# EAGLE schematic Xbee Communications Board (EAGLE 9.6.1)
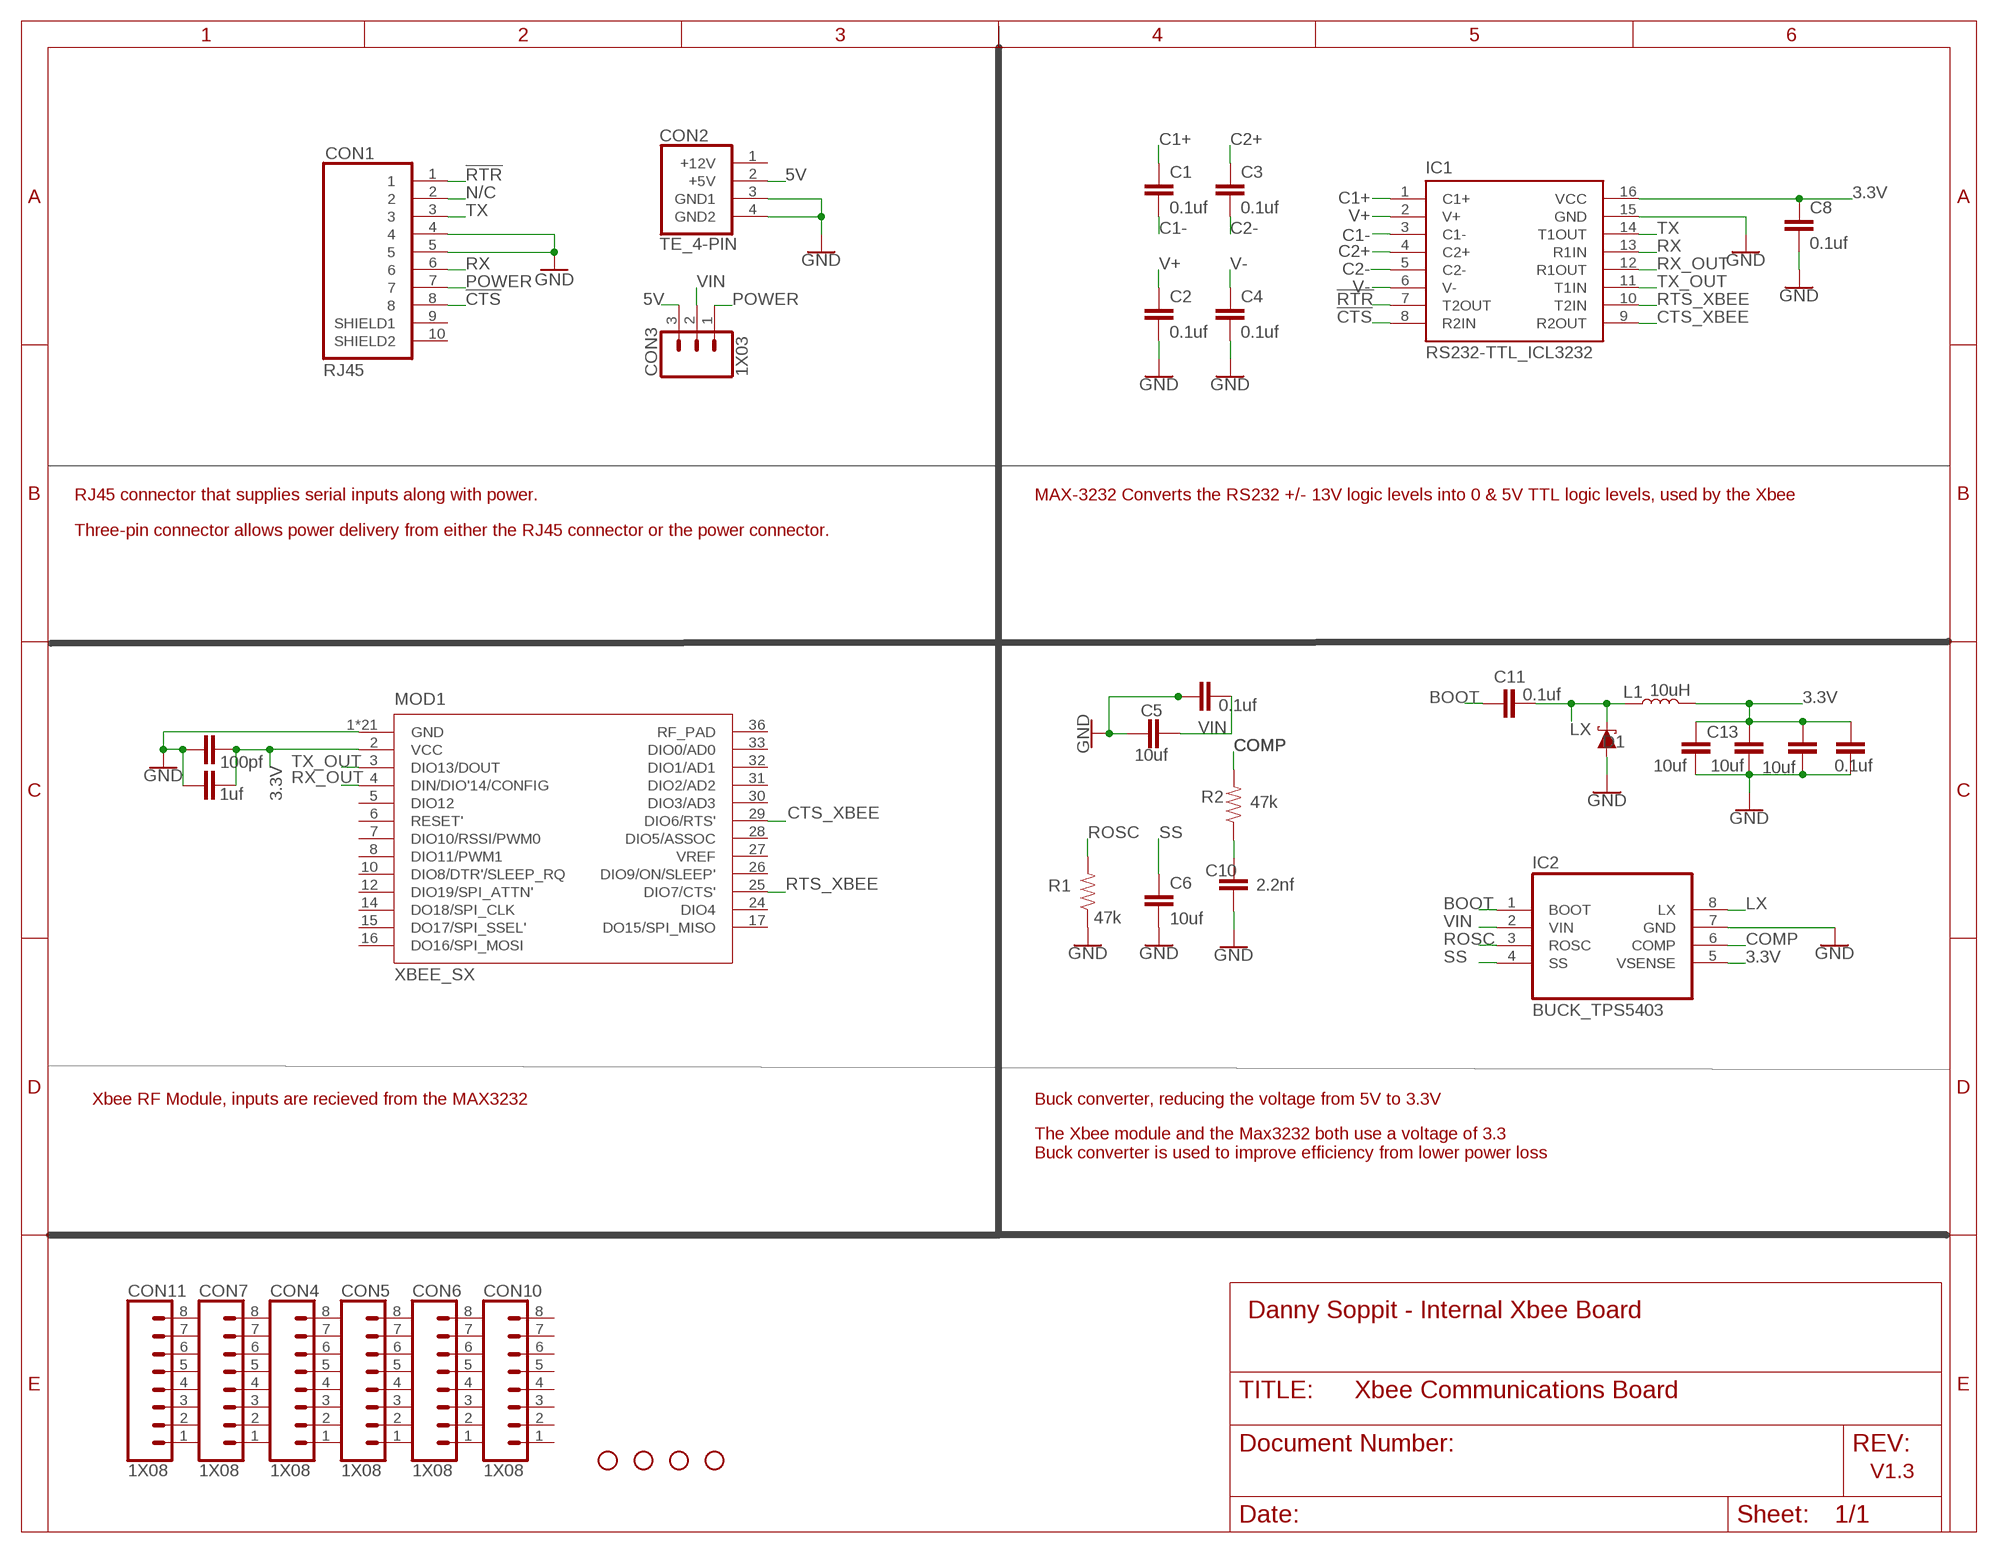
[diagram p0: schematic, sheet 1]

## Parts
C1  0.1uf  CAPACITOR_0805  [0805]
C2  0.1uf  CAPACITOR_0805  [0805]
C3  0.1uf  CAPACITOR_0805  [0805]
C4  0.1uf  CAPACITOR_0805  [0805]
C5  10uf  CAPACITOR_0805  [0805]
C6  10uf  CAPACITOR_0805  [0805]
C7  0.1uf  CAPACITOR_0805  [0805]
C8  0.1uf  CAPACITOR_0805  [0805]
C9  100pf  CAPACITOR_0805  [0805]
C10  2.2nf  CAPACITOR_0805  [0805]
C11  0.1uf  CAPACITOR_0805  [0805]
C12  10uf  CAPACITOR_0805  [0805]
C13  10uf  CAPACITOR_0805  [0805]
C14  10uf  CAPACITOR_0805  [0805]
C15  0.1uf  CAPACITOR_0805  [0805]
C16  1uf  CAPACITOR_0805  [0805]
CON1  RJ45  [RJ45]
CON2  TE_4-PIN  [TE_4-PIN]
CON3  1X03  [1X03]
CON4  1X08  [1X08]
CON5  1X08  [1X08]
CON6  1X08  [1X08]
CON7  1X08  [1X08]
CON10  1X08  [1X08]
CON11  1X08  [1X08]
D1  DIODE_SCHOTTKY_DO-214AA  [DO214AA]
H1  STAND-OFF  [STAND-OFF]
H2  STAND-OFF  [STAND-OFF]
H3  STAND-OFF  [STAND-OFF]
H4  STAND-OFF  [STAND-OFF]
IC1  RS232-TTL_ICL3232  [DIP16]
IC2  BUCK_TPS5403  [SOIC8]
L1  10uH  INDUCTOR_MURATA_DEM8030C  [INDUCTOR_MURATA_DEM8030C]
MOD1  XBEE_SX  [XBEE_SX]
R1  47k  RESISTOR_0805  [0805]
R2  47k  RESISTOR_0805  [0805]

## Nets
3.3V: C8.1 C9.2 C12.1 C13.2 C14.2 C15.2 C16.2 IC1.16(VCC) IC2.5(VSENSE) L1.P$2 MOD1.2(VCC)
5V: CON2.2(+5V) CON3.3
!CTS: CON1.8 IC1.8(R2IN)
!RTR: CON1.1 IC1.7(T2OUT)
BOOT: C11.1 IC2.1(BOOT)
C1+: C1.1 IC1.1(C1+)
C1-: C1.2 IC1.3(C1-)
C2+: C3.1 IC1.4(C2+)
C2-: C3.2 IC1.5(C2-)
COMP: IC2.6(COMP) R2.2
CTS_XBEE: IC1.9(R2OUT) MOD1.29(DIO6/RTS')
GND: C2.2 C4.2 C5.1 C6.2 C7.1 C8.2 C9.1 C10.1 C12.2 C13.1 C14.1 C15.1 C16.1 CON1.4 CON1.5 CON2.3(GND1) CON2.4(GND2) D1.A IC1.15(GND) IC2.7(GND) MOD1.1(GND) MOD1.11(GND) MOD1.13(GND) MOD1.22(GND) MOD1.35(GND) MOD1.38_1(GND) MOD1.38_2(GND) MOD1.38_3(GND) MOD1.38_4(GND) MOD1.38_5(GND) MOD1.38_6(GND) MOD1.38_7(GND) MOD1.38_8(GND) MOD1.38_9(GND) MOD1.38_10(GND) MOD1.38_11(GND) MOD1.38_12(GND) MOD1.38_13(GND) MOD1.38_14(GND) MOD1.38_15(GND) MOD1.38_16(GND) R1.1
LX: C11.2 D1.C IC2.8(LX) L1.P$1
N$2: C10.2 R2.1
N/C: CON1.2
POWER: CON1.7 CON3.1
ROSC: IC2.3(ROSC) R1.2
RTS_XBEE: IC1.10(T2IN) MOD1.25(DIO7/CTS')
RX: CON1.6 IC1.13(R1IN)
RX_OUT: IC1.12(R1OUT) MOD1.4(DIN/DIO'14/CONFIG)
SS: C6.1 IC2.4(SS)
TX: CON1.3 IC1.14(T1OUT)
TX_OUT: IC1.11(T1IN) MOD1.3(DIO13/DOUT)
V+: C2.1 IC1.2(V+)
V-: C4.1 IC1.6(V-)
VIN: C5.2 C7.2 CON3.2 IC2.2(VIN)
Unconnected: CON1.9(SHIELD1) CON1.10(SHIELD2) CON2.1(+12V) CON4.1 CON4.2 CON4.3 CON4.4 CON4.5 CON4.6 CON4.7 CON4.8 CON5.1 CON5.2 CON5.3 CON5.4 CON5.5 CON5.6 CON5.7 CON5.8 CON6.1 CON6.2 CON6.3 CON6.4 CON6.5 CON6.6 CON6.7 CON6.8 CON7.1 CON7.2 CON7.3 CON7.4 CON7.5 CON7.6 CON7.7 CON7.8 CON10.1 CON10.2 CON10.3 CON10.4 CON10.5 CON10.6 CON10.7 CON10.8 CON11.1 CON11.2 CON11.3 CON11.4 CON11.5 CON11.6 CON11.7 CON11.8 MOD1.5(DIO12) MOD1.6(RESET') MOD1.7(DIO10/RSSI/PWM0) MOD1.8(DIO11/PWM1) MOD1.10(DIO8/DTR'/SLEEP_RQ) MOD1.12(DIO19/SPI_ATTN') MOD1.14(DO18/SPI_CLK) MOD1.15(DO17/SPI_SSEL') MOD1.16(DO16/SPI_MOSI) MOD1.17(DO15/SPI_MISO) MOD1.24(DIO4) MOD1.26(DIO9/ON/SLEEP') MOD1.27(VREF) MOD1.28(DIO5/ASSOC) MOD1.30(DIO3/AD3) MOD1.31(DIO2/AD2) MOD1.32(DIO1/AD1) MOD1.33(DIO0/AD0) MOD1.36(RF_PAD)

## Notes on the sheet
- RJ45 connector that supplies serial inputs along with power. | MAX-3232 Converts the RS232 +/- 13V logic levels into 0 & 5V TTL logic levels, used by the Xbee
- Three-pin connector allows power delivery from either the RJ45 connector or the power connector.
- Xbee RF Module, inputs are recieved from the MAX3232 | Buck converter, reducing the voltage from 5V to 3.3V
- The Xbee module and the Max3232 both use a voltage of 3.3
  Buck converter is used to improve efficiency from lower power loss
- Danny Soppit - Internal Xbee Board
- V1.3

## Library data of the parts
C1-C16 = EcoCar-Passives:CAPACITOR_0805
CON1 = EcoCar-Connectors:RJ45: RJ45 Connector - Use for signals and low power connections Unshielded Part Number: RJHSE-5080 Unshielded Digikey Part Number: RJHSE-5080-ND Shielded Part Number: RJHSE5E80 Shielded Digikey Part Number: RJHSE5E80-ND
CON2 = EcoCar-Connectors:TE_4-PIN: 4 Pin TE Mini-Universal MATE-N-LOK - Use for 12V and 5V connections Part Number: 1-770968-0 Digikey Part Number: A32474-ND Matching Plug: A25571-ND Matching Crimps: A100828CT-ND
CON3 = EcoCar-Connectors-2.54mm:1X03: 2.54mm (0.1") Header
CON4-CON7 CON10 CON11 = EcoCar-Connectors-2.54mm:1X08: 2.54mm (0.1") Header
D1 = EcoCar-Discrete-Semiconductors:DIODE_SCHOTTKY_DO-214AA
H1-H4 = EcoCar-Miscellaneous:STAND-OFF: Stand Off Drill holes for mechanically mounting via screws, standoffs, etc. Note: Use the keepout ring to avoid running the screw head into surrounding components. Variant Overviews STAND-OFF - Mechanical footprint for a #4 phillips button head screw. STAND-OFF-TIGHT - Mechanical footprint for a #4 phillips button head screw, Example SparkFun Products Screw - Phillips Head (1/4", 4-40, 10 pack) <https://www.sparkfun.com/products/10453> (PRT-10453) Screw - Phillips Head (1/2", 4-40, 10 pack) <https://www.sparkfun.com/products/10452> (PRT-10452) Screw - Phillips Head (3/4", 4-40, 10 pack) <https://www.sparkfun.com/products/10451> (PRT-10451) Screw - Phillips Head (1", 4-40, 10 pack) <https://www.sparkfun.com/products/10450> (PRT-10450)
IC1 = EcoCar-Integrated-Circuits:RS232-TTL_ICL3232: Dual 3.3V TTL to RS-232 Converter Manufacturer: Renesas Part Number: ICL3232CPZ Digikey Part Number: ICL3232CPZ-ND
IC2 = EcoCar-Integrated-Circuits:BUCK_TPS5403: 3.3V, 1.7A Buck Converter Manufacturer: Texas Instruments Part Number: TPS5403DR Digikey Part Number: 296-34972-1-ND
L1 = EcoCar-Passives:INDUCTOR_MURATA_DEM8030C: Murata DEM8030C Series Inductor Manufacturer: Murata Series: DEM8030C Example Part: 10uH 3.1A Part Number: 1273AS-H-100M=P3 Digikey Part Number: 490-10837-1-ND
MOD1 = EcoCar-Modules:XBEE_SX: Digi Xbee SX/SX Pro RF Module Manufacturer: Digi
R1 R2 = EcoCar-Passives:RESISTOR_0805